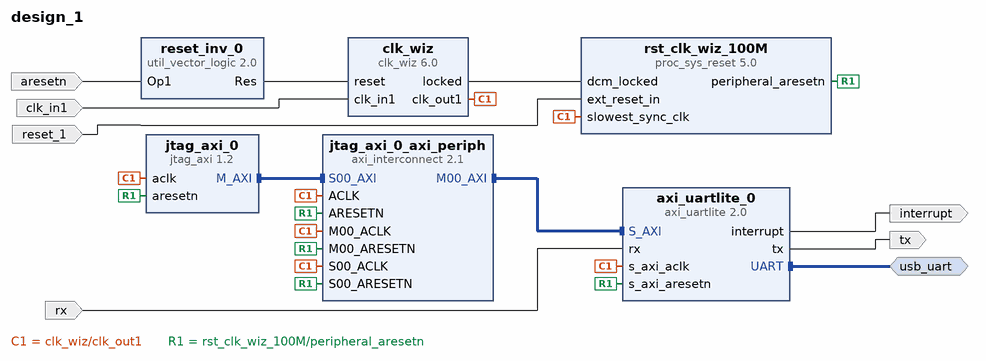
[diagram p0: block diagram of the top level]
# Vivado block design design_1, xc7a100tcsg324-1, Vivado 2019.2
create_bd_design design_1

create_bd_intf_port -mode Master -vlnv xilinx.com:interface:uart_rtl:1.0 usb_uart
create_bd_port -dir I -type clk clk_in1
set_property -dict {CONFIG.ASSOCIATED_RESET reset_1 CONFIG.FREQ_HZ 100000000 CONFIG.PHASE 0.000} [get_bd_ports clk_in1]
create_bd_port -dir I -type rst aresetn
set_property -dict {CONFIG.POLARITY ACTIVE_LOW} [get_bd_ports aresetn]
create_bd_port -dir I -type rst reset_1
set_property -dict {CONFIG.POLARITY ACTIVE_LOW} [get_bd_ports reset_1]
create_bd_port -dir I rx
create_bd_port -dir O tx
create_bd_port -dir O -type intr interrupt

create_bd_cell -type ip -vlnv xilinx.com:ip:jtag_axi:1.2 jtag_axi_0
create_bd_cell -type ip -vlnv xilinx.com:ip:axi_uartlite:2.0 axi_uartlite_0
set_property -dict {CONFIG.UARTLITE_BOARD_INTERFACE usb_uart CONFIG.USE_BOARD_FLOW true} [get_bd_cells axi_uartlite_0]
create_bd_cell -type ip -vlnv xilinx.com:ip:axi_interconnect:2.1 jtag_axi_0_axi_periph
set_property -dict {CONFIG.NUM_MI 1} [get_bd_cells jtag_axi_0_axi_periph]
create_bd_cell -type ip -vlnv xilinx.com:ip:clk_wiz:6.0 clk_wiz
set_property -dict [list \
  CONFIG.CLK_IN1_BOARD_INTERFACE sys_clock \
  CONFIG.RESET_BOARD_INTERFACE reset \
  CONFIG.USE_BOARD_FLOW true \
] [get_bd_cells clk_wiz]
create_bd_cell -type ip -vlnv xilinx.com:ip:proc_sys_reset:5.0 rst_clk_wiz_100M
set_property -dict {CONFIG.RESET_BOARD_INTERFACE reset CONFIG.USE_BOARD_FLOW true} [get_bd_cells rst_clk_wiz_100M]
create_bd_cell -type ip -vlnv xilinx.com:ip:util_vector_logic:2.0 reset_inv_0
set_property -dict {CONFIG.C_OPERATION not CONFIG.C_SIZE 1} [get_bd_cells reset_inv_0]

# ---- connections ----

connect_bd_intf_net [get_bd_intf_pins jtag_axi_0/M_AXI] [get_bd_intf_pins jtag_axi_0_axi_periph/S00_AXI]
connect_bd_intf_net [get_bd_intf_pins jtag_axi_0_axi_periph/M00_AXI] [get_bd_intf_pins axi_uartlite_0/S_AXI]
connect_bd_intf_net [get_bd_intf_ports usb_uart] [get_bd_intf_pins axi_uartlite_0/UART]
connect_bd_net [get_bd_pins clk_wiz/clk_out1] \
  [get_bd_pins jtag_axi_0/aclk] [get_bd_pins jtag_axi_0_axi_periph/S00_ACLK] [get_bd_pins rst_clk_wiz_100M/slowest_sync_clk] \
  [get_bd_pins axi_uartlite_0/s_axi_aclk] [get_bd_pins jtag_axi_0_axi_periph/M00_ACLK] \
  [get_bd_pins jtag_axi_0_axi_periph/ACLK]
connect_bd_net [get_bd_pins clk_wiz/locked] [get_bd_pins rst_clk_wiz_100M/dcm_locked]
connect_bd_net [get_bd_pins rst_clk_wiz_100M/peripheral_aresetn] \
  [get_bd_pins jtag_axi_0/aresetn] [get_bd_pins jtag_axi_0_axi_periph/S00_ARESETN] [get_bd_pins axi_uartlite_0/s_axi_aresetn] \
  [get_bd_pins jtag_axi_0_axi_periph/M00_ARESETN] [get_bd_pins jtag_axi_0_axi_periph/ARESETN]
connect_bd_net -net sys_clock_1 [get_bd_ports clk_in1] [get_bd_pins clk_wiz/clk_in1]
connect_bd_net -net reset_1 [get_bd_ports aresetn] [get_bd_pins reset_inv_0/Op1]
connect_bd_net [get_bd_pins reset_inv_0/Res] [get_bd_pins clk_wiz/reset]
connect_bd_net -net reset_0_1 [get_bd_ports reset_1] [get_bd_pins rst_clk_wiz_100M/ext_reset_in]
connect_bd_net -net rx_0_1 [get_bd_ports rx] [get_bd_pins axi_uartlite_0/rx]
connect_bd_net [get_bd_pins axi_uartlite_0/tx] [get_bd_ports tx]
connect_bd_net [get_bd_pins axi_uartlite_0/interrupt] [get_bd_ports interrupt]

# ---- address map ----
assign_bd_address -offset 0x40600000 -range 64K -target_address_space [get_bd_addr_spaces jtag_axi_0/Data] [get_bd_addr_segs axi_uartlite_0/S_AXI/Reg]

validate_bd_design
save_bd_design
